# Altium schematic sheet lipo-charger-200mAh.SchDoc
size A
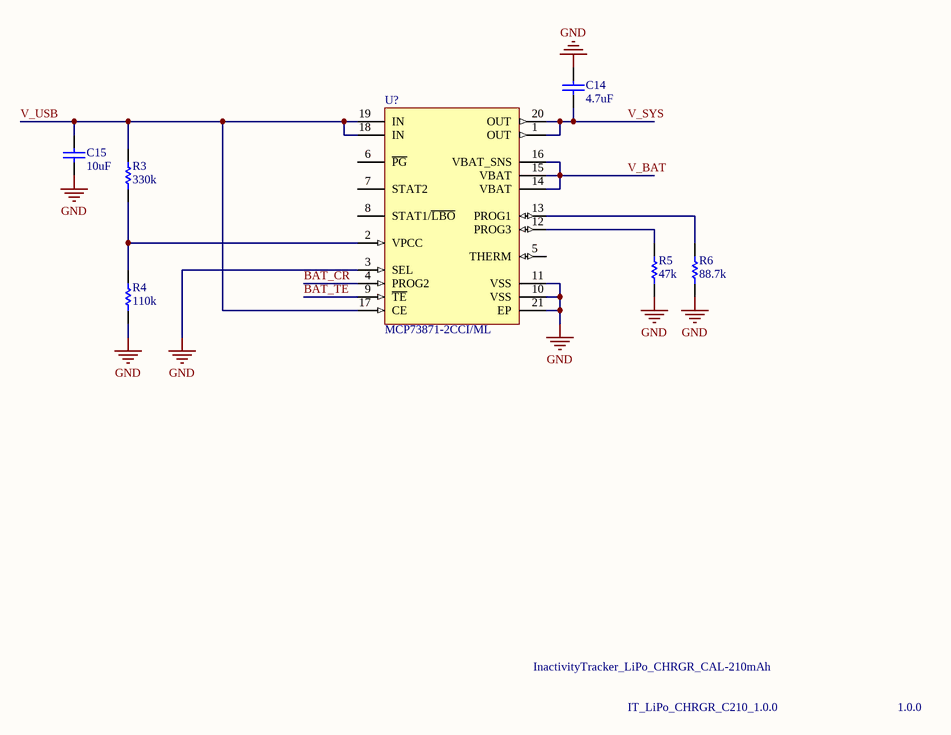
[diagram p0: lipo-charger-200mAh.SchDoc]

## Parts
C14  4.7uF  [CAPC1005X55X25NL05T10]
C15  10uF  [CAPC1005X55X25NL05T10]
R3  330k  [RESC1005X40X25NL05T05]
R4  110k  [RESC1005X40X25NL05T05]
R5  47k  [RESC1005X40X25LL05T05]
R6  88.7k  [RESC1005X40X25NL05T05]
U?  MCP73871-2CCI/ML  [QFN-ML20_M]

## Nets
GND: C14.2 C15.2 R4.2 R5.2 R6.1 U?.3(SEL) U?.10(VSS) U?.11(VSS) U?.21(EP)
BAT_CR: U?.4(PROG2)
BAT_TE: U?.9(~{TE})
V_BAT: U?.14(VBAT) U?.15(VBAT) U?.16(VBAT_SNS)
V_SYS: C14.1 U?.1(OUT) U?.20(OUT)
V_USB: C15.1 R3.1 U?.17(CE) U?.18(IN) U?.19(IN)
NetR3_2: R3.2 R4.1 U?.2(VPCC)
NetR5_1: R5.1 U?.12(PROG3)
NetR6_2: R6.2 U?.13(PROG1)

Not connected (* = marked no-connect by the designer): U? 5(THERM) 6(~{PG}) 7(STAT2) 8(STAT1/~{LBO})

## Notes on the sheet
- InactivityTracker_LiPo_CHRGR_CAL-210mAh
- IT_LiPo_CHRGR_C210_1.0.0
- 1.0.0

## Library data of the parts
C14 = CMP-2008-03967-1: Manufacturer: Murata; Part Number: GRM155R61C102KA01D
C15 = CMP-2008-04556-1: Part Number: GRM155R61A105KE15D; Manufacturer: Murata
R3 = CMP-2002-08521-1: Manufacturer: Vishay Dale; Part Number: CRCW0402330KFKED
R4 = CMP-2002-08148-1: Manufacturer: Vishay Dale; Part Number: CRCW0402110KFKED
R5 = CMP-2002-00026-1: Manufacturer: Vishay Dale; Part Number: CRCW040247K0JNED
R6 = CMP-2002-00251-1: Manufacturer: Vishay Dale; Part Number: CRCW040288K7FKED
U? = CMP-0133-00005-1: Stand-Alone System Load Sharing and Li-Ion/Li-Polymer Battery Charge Management Controller, 4.2V, 20-Pin QFN, Industrial Temperature; PackageDescription: 20-Lead Plastic Quad Flat, No Lead Package (ML) - 4x4x0.9 mm Body [QFN]; PackageReference: QFN-ML20; PackageVersion: revBB, Aug-2009; DatasheetVersion: revB, May-2009